# Altium project zxevo.PrjPcb (part 2 of 2)
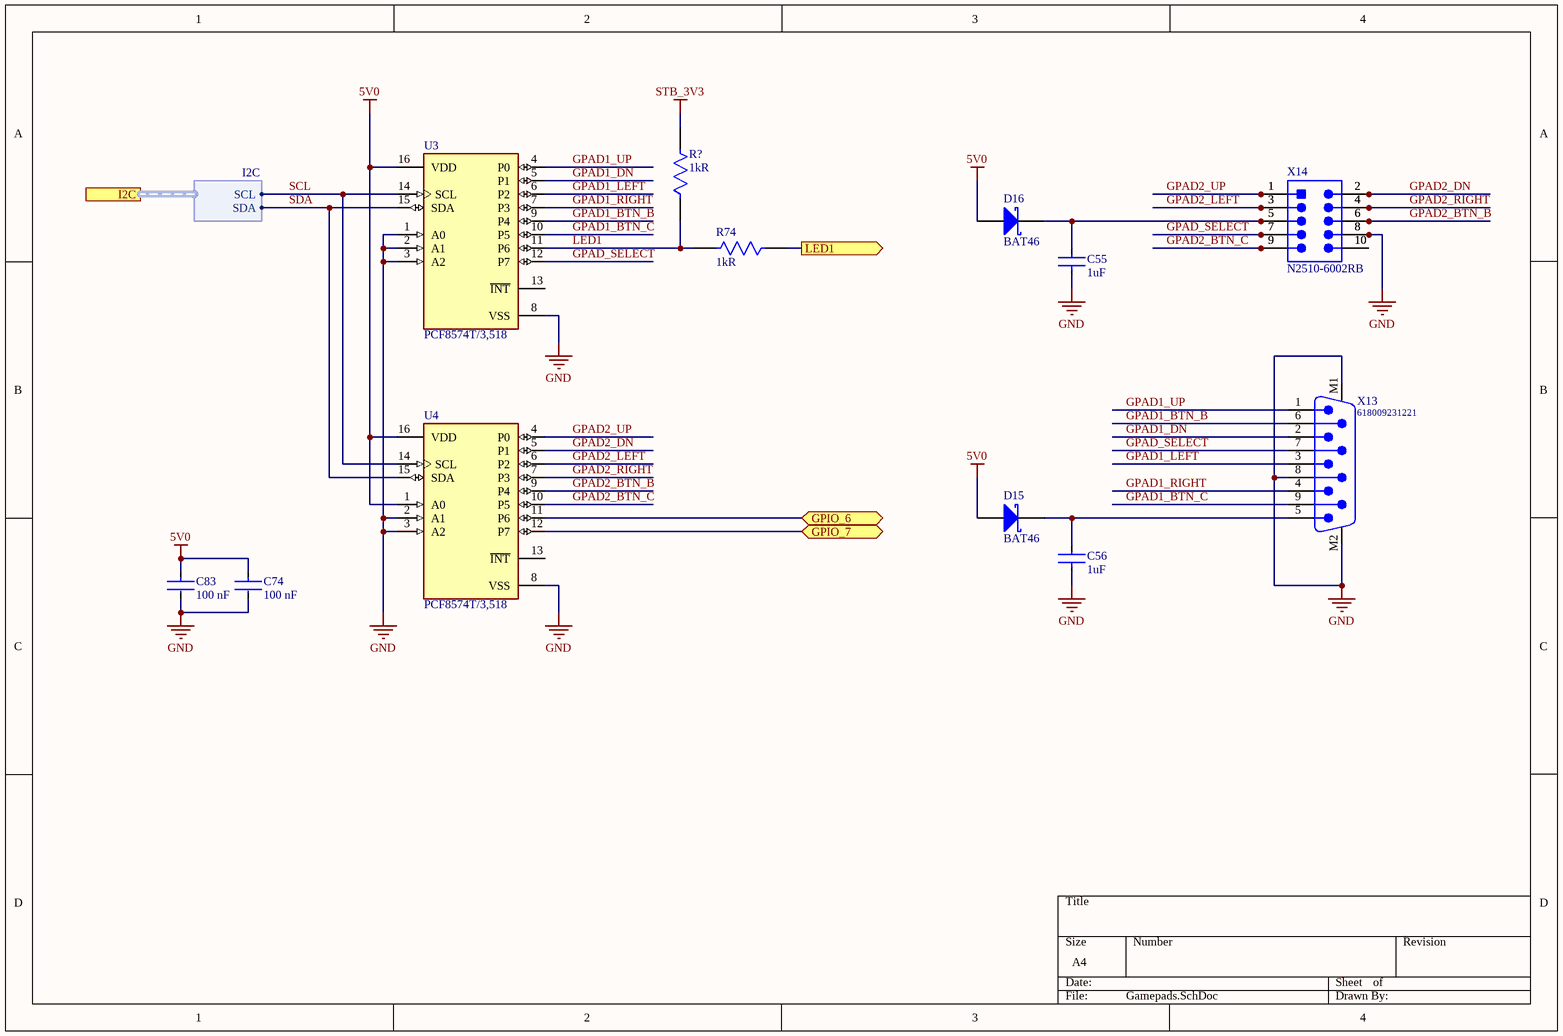
[diagram p10: Gamepads.SchDoc]

## Nets that join several sheets
2V5: FPGA (12 pins), Power ATX (8 pins)
3V3: FPGA (22 pins), CPLD (16 pins), Video out (8 pins), SDCARD (7 pins), Power ATX (10 pins), USB (C38.1 D8.4 D8.16)
5V0: FPGA (6 pins), Memory (14 pins), BUS (10 pins), Power ATX (9 pins), USB (13 pins), Gamepads (7 pins)
GND: FPGA (36 pins), Memory (14 pins), BUS (18 pins), CPLD (16 pins), Video out (26 pins), SDCARD (12 pins), Power ATX (29 pins), USB (31 pins), Gamepads (15 pins)
STB_3V3: Power ATX (VD4.3), Gamepads (R?.2)
VCC12: BUS (C3.1 J1.0), Power ATX (PWR1.10)
A0: FPGA (D9.44), BUS (XS1.A9 XS2.A9)
A1: FPGA (D9.41), BUS (XS1.A10 XS2.A10)
A2: FPGA (D9.40), BUS (XS1.A11 XS2.A11)
A3: FPGA (D9.39), BUS (XS1.A12 XS2.A12)
A4: FPGA (D9.38), BUS (XS1.A24 XS2.A24)
A5: FPGA (D9.37), BUS (XS1.A23 XS2.A23)
A6: FPGA (D9.36), BUS (XS1.A22 XS2.A22)
A7: FPGA (D9.31), BUS (XS1.A21 XS2.A21)
A8: FPGA (D9.30), BUS (XS1.B26 XS2.B26)
A9: FPGA (D9.29), BUS (XS1.A27 XS2.A27)
A10: FPGA (D9.28), BUS (XS1.B27 XS2.B27)
A11: FPGA (D9.27), BUS (XS1.A28 XS2.A28)
A12: FPGA (D9.26), BUS (XS1.A2 XS2.A2)
A13: FPGA (D9.25), BUS (XS1.B2 XS2.B2)
A14: FPGA (D9.24), BUS (XS1.A1 XS2.A1)
A15: FPGA (D9.19), BUS (XS1.B1 XS2.B1)
~{CSROM}: FPGA (D3.6), BUS (R10.2 XS1.A25 XS2.A25)
D0: FPGA (D9.18), BUS (XS1.B6 XS2.B6)
D1: FPGA (D9.17), BUS (XS1.B7 XS2.B7)
D2: FPGA (D9.16), BUS (XS1.B8 XS2.B8)
D3: FPGA (D9.15), BUS (XS1.B11 XS2.B11)
D4: FPGA (D9.14), BUS (XS1.B12 XS2.B12)
D5: FPGA (D9.13), BUS (XS1.B10 XS2.B10)
D6: FPGA (D9.12), BUS (XS1.B9 XS2.B9)
D7: FPGA (D9.11), BUS (XS1.B3 XS2.B3)
~{DOS}: FPGA (D9.160), BUS (XS1.A4 XS2.A4)
DAC_CLK: FPGA (D9.103), CPLD (U7.12), Video out (U6.24)
FPGA_SEL0: FPGA (D9.97), CPLD (U7.74)
FPGA_SEL1: FPGA (D9.99), CPLD (U7.75)
HSYNC: FPGA (D9.111), CPLD (U7.51), Video out (R91.1)
I2C.SCL: FPGA (X22.3 X23.3 X24.3), Gamepads (U3.14 U4.14)
I2C.SDA: FPGA (X22.2 X23.2 X24.2), Gamepads (U3.15 U4.15)
~{INT}: FPGA (D9.10), BUS (XS1.B13 XS2.B13)
~{IORQ1}: FPGA (D9.148), BUS (XS1.B17)
~{IORQ2}: FPGA (D9.149), BUS (XS1.B31 XS2.B17)
IORQGE1: FPGA (D9.78), BUS (R11.2 XS1.A13)
IORQGE2: FPGA (D9.80), BUS (R9.2 XS1.A31 XS2.A13)
~{M1}: FPGA (D9.144), BUS (XS1.B24 XS2.B24)
~{MREQ}: FPGA (D9.8), BUS (XS1.B16 XS2.B16)
~{NMI}: FPGA (D9.9), BUS (XS1.B14 XS2.B14)
NetR74_1: FPGA (VD5.A), Gamepads (R74.1)
~{RD}: FPGA (D9.141), BUS (XS1.B18 XS2.B18)
~{RES}: FPGA (R13.2), BUS (XS1.A20 XS2.A20)
~{RFSH}: FPGA (D9.147), BUS (XS1.B25 XS2.B25)
~{RLCAS}: FPGA (R41.2), Memory (RAM1.31 RAM2.31)
~{RRAS0}: FPGA (R42.2), Memory (RAM2.14)
~{RRAS1}: FPGA (R39.2), Memory (RAM1.14)
~{RUCAS}: FPGA (R40.2), Memory (RAM1.29 RAM1.30 RAM2.29 RAM2.30)
~{RWE}: FPGA (D9.187), Memory (RAM1.13 RAM2.13)
RA0: FPGA (D9.177), Memory (RAM1.17 RAM2.17)
RA1: FPGA (D9.175), Memory (RAM1.18 RAM2.18)
RA2: FPGA (D9.173), Memory (RAM1.19 RAM2.19)
RA3: FPGA (D9.170), Memory (RAM1.20 RAM2.20)
RA4: FPGA (D9.169), Memory (RAM1.23 RAM2.23)
RA5: FPGA (D9.172), Memory (RAM1.24 RAM2.24)
RA6: FPGA (D9.174), Memory (RAM1.25 RAM2.25)
RA7: FPGA (D9.176), Memory (RAM1.26 RAM2.26)
RA8: FPGA (D9.179), Memory (RAM1.27 RAM2.27)
RA9: FPGA (D9.180), Memory (RAM1.28 RAM2.28)
RD0: FPGA (D9.208), Memory (RAM1.2 RAM2.2)
RD1: FPGA (D9.206), Memory (RAM1.3 RAM2.3)
RD2: FPGA (D9.204), Memory (RAM1.4 RAM2.4)
RD3: FPGA (D9.202), Memory (RAM1.5 RAM2.5)
RD4: FPGA (D9.199), Memory (RAM1.7 RAM2.7)
RD5: FPGA (D9.197), Memory (RAM1.8 RAM2.8)
RD6: FPGA (D9.195), Memory (RAM1.9 RAM2.9)
RD7: FPGA (D9.192), Memory (RAM1.10 RAM2.10)
RD8: FPGA (D9.191), Memory (RAM1.33 RAM2.33)
RD9: FPGA (D9.193), Memory (RAM1.34 RAM2.34)
RD10: FPGA (D9.196), Memory (RAM1.35 RAM2.35)
RD11: FPGA (D9.198), Memory (RAM1.36 RAM2.36)
RD12: FPGA (D9.200), Memory (RAM1.38 RAM2.38)
RD13: FPGA (D9.203), Memory (RAM1.39 RAM2.39)
RD14: FPGA (D9.205), Memory (RAM1.40 RAM2.40)
RD15: FPGA (D9.207), Memory (RAM1.41 RAM2.41)
RS: FPGA (R12.2), BUS (XS1.A16 XS2.A16)
~{SD0_SSEL}: CPLD (U7.92), SDCARD (CD1.2)
~{SD1_SSEL}: CPLD (U7.88), SDCARD (CD2.2 X25.1)
~{SOFTRST}: CPLD (U7.4), USB (U2.17)
~{SPI_SLAVE_SSEL}: FPGA (D9.182), CPLD (U7.5)
SD0_MISO: CPLD (U7.97), SDCARD (CD1.7 R81.1)
SD0_MOSI: CPLD (U7.95), SDCARD (CD1.3)
SD0_SCLK: CPLD (U7.96), SDCARD (CD1.5)
SD1_MISO: CPLD (U7.91), SDCARD (CD2.7 R78.1 X25.6)
SD1_MOSI: CPLD (U7.89), SDCARD (CD2.3 X25.2)
SD1_SCLK: CPLD (U7.90), SDCARD (CD2.5 X25.4)
SPI_HOST.MISO: FPGA (D9.115), CPLD (U7.48)
SPI_HOST.MOSI: FPGA (D9.116), CPLD (U7.47)
SPI_HOST.~{SSEL}: FPGA (D9.119), CPLD (U7.44)
SPI_HOST.SCLK: FPGA (R60.2), CPLD (U7.49)
SPI_SLAVE.MISO: FPGA (D9.158), CPLD (U7.8)
SPI_SLAVE.MOSI: FPGA (D9.157), CPLD (U7.7)
SPI_SLAVE.SCLK: FPGA (D9.184), CPLD (U7.6)
TCK_FPGA: FPGA (D9.1 R72.2 X15.1), CPLD (U7.24)
TDO_CPLD: FPGA (X15.3), CPLD (U7.25)
TDO_FPGA: FPGA (D9.4), CPLD (U7.23)
TMS_FPGA: FPGA (D9.50 R73.2 X15.5), CPLD (U7.22)
VDAT0: FPGA (D9.96), CPLD (U7.52)
VDAT1: FPGA (D9.94), CPLD (U7.54)
VDAT2: FPGA (D9.92), CPLD (U7.56)
VDAT3: FPGA (D9.89), CPLD (U7.58)
VDAT4: FPGA (D9.87), CPLD (U7.64)
VDAT5: FPGA (D9.85), CPLD (U7.67)
VDAT6: FPGA (D9.75), CPLD (U7.69)
VDAT7: FPGA (D9.73), CPLD (U7.71)
VDAT8: FPGA (D9.71), CPLD (U7.72)
VDAT9: FPGA (D9.74), CPLD (U7.70)
VDAT10: FPGA (D9.83), CPLD (U7.68)
VDAT11: FPGA (D9.86), CPLD (U7.66)
VDAT12: FPGA (D9.88), CPLD (U7.61)
VDAT13: FPGA (D9.90), CPLD (U7.57)
VDAT14: FPGA (D9.93), CPLD (U7.55)
VDAT15: FPGA (D9.95), CPLD (U7.53)
VSYNC: FPGA (D9.112), CPLD (U7.50), Video out (R90.1)
~{WAIT}: FPGA (D9.143), BUS (XS1.B21 XS2.B21)
~{WR}: FPGA (D9.140), BUS (XS1.B19 XS2.B19)